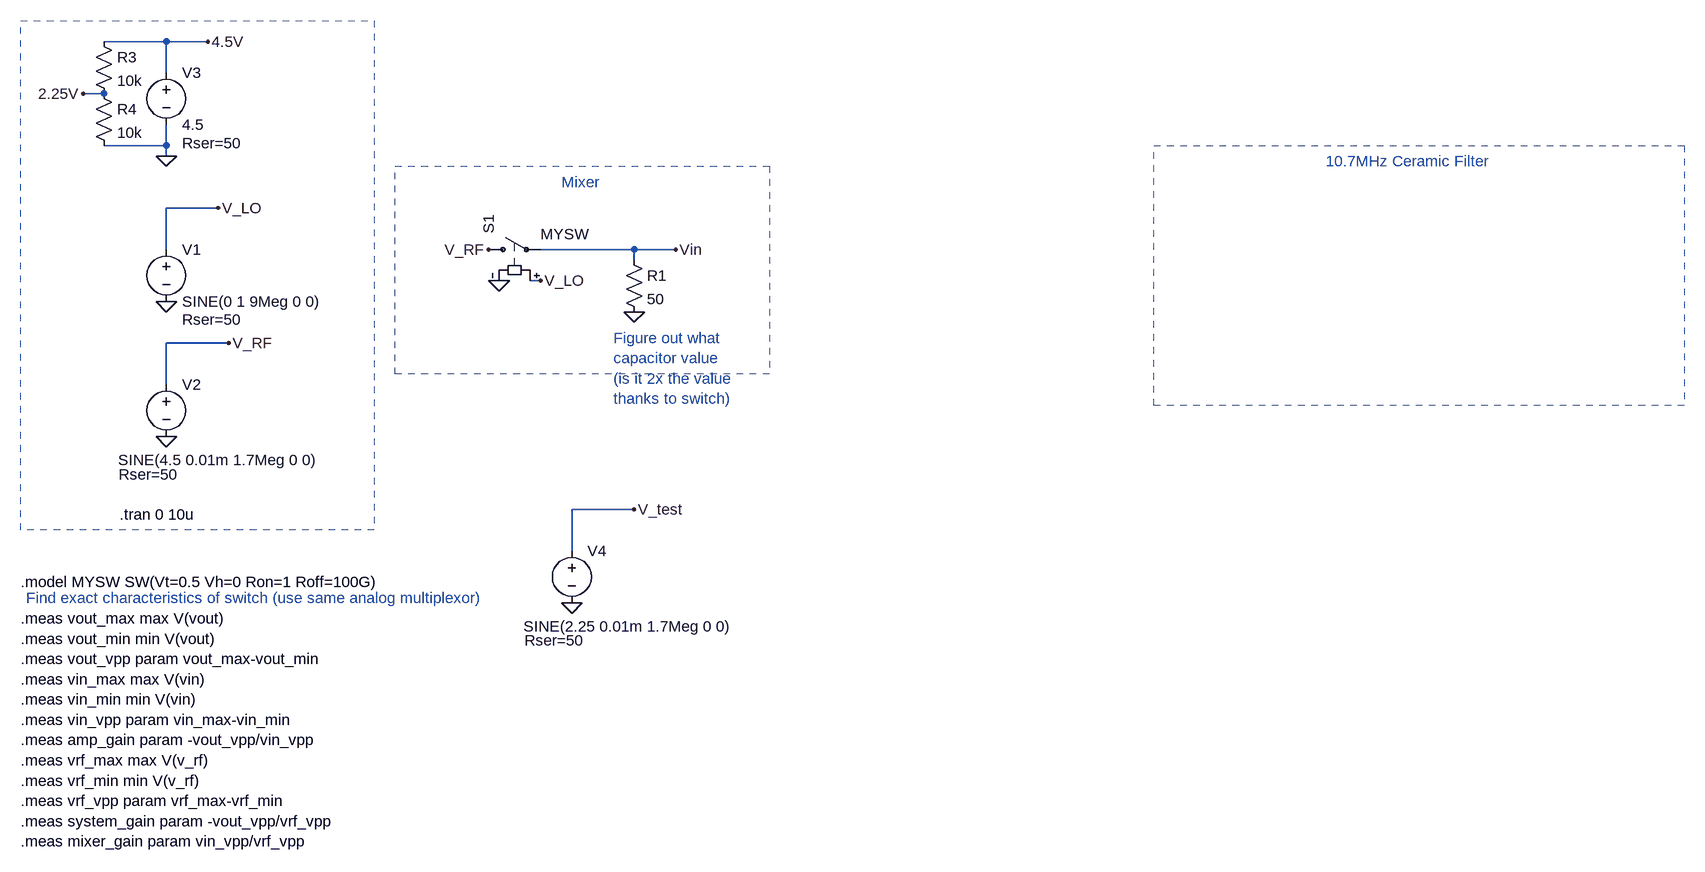
[diagram p0: schematic AM_Mixer.asc]
AM_Mixer.asc, the LTspice schematic file:
Version 4
SHEET 1 2308 1124
WIRE -368 -144 -464 -144
WIRE -304 -144 -368 -144
WIRE -368 -96 -368 -144
WIRE -464 -64 -496 -64
WIRE -368 16 -368 -16
WIRE -368 16 -464 16
WIRE -368 32 -368 16
WIRE -288 112 -368 112
WIRE -368 176 -368 112
WIRE 352 176 208 176
WIRE 416 176 352 176
WIRE 352 192 352 176
WIRE 208 224 192 224
WIRE -272 320 -368 320
WIRE -368 384 -368 320
WIRE 352 576 256 576
WIRE 256 640 256 576
FLAG -368 256 0
FLAG -288 112 V_LO
FLAG -368 464 0
FLAG -368 32 0
FLAG -304 -144 4.5V
FLAG -272 320 V_RF
FLAG 144 224 0
FLAG 208 224 V_LO
FLAG 352 272 0
FLAG 128 176 V_RF
FLAG 416 176 Vin
FLAG -496 -64 2.25V
FLAG 256 720 0
FLAG 352 576 V_test
SYMBOL voltage -368 160 R0
WINDOW 123 0 0 Left 0
WINDOW 39 24 124 Left 2
SYMATTR SpiceLine Rser=50
SYMATTR InstName V1
SYMATTR Value SINE(0 1 9Meg 0 0)
SYMBOL voltage -368 368 R0
WINDOW 123 0 0 Left 0
WINDOW 39 -73 154 Left 2
WINDOW 3 -74 132 Left 2
SYMATTR SpiceLine Rser=50
SYMATTR Value SINE(4.5 0.01m 1.7Meg 0 0)
SYMATTR InstName V2
SYMBOL voltage -368 -112 R0
WINDOW 123 0 0 Left 0
WINDOW 39 24 124 Left 2
SYMATTR SpiceLine Rser=50
SYMATTR InstName V3
SYMATTR Value 4.5
SYMBOL sw 112 176 R270
WINDOW 3 24 96 VRight 2
SYMATTR Value MYSW
SYMATTR InstName S1
SYMBOL res -480 -160 R0
SYMATTR InstName R3
SYMATTR Value 10k
SYMBOL res -480 -80 R0
SYMATTR InstName R4
SYMATTR Value 10k
SYMBOL voltage 256 624 R0
WINDOW 123 0 0 Left 0
WINDOW 39 -73 154 Left 2
WINDOW 3 -74 132 Left 2
SYMATTR SpiceLine Rser=50
SYMATTR Value SINE(2.25 0.01m 1.7Meg 0 0)
SYMATTR InstName V4
SYMBOL res 336 176 R0
SYMATTR InstName R1
SYMATTR Value 50
TEXT -440 584 Left 2 !.tran 0 10u
TEXT -592 688 Left 2 !.model MYSW SW(Vt=0.5 Vh=0 Ron=1 Roff=100G)
TEXT -592 744 Left 2 !.meas vout_max max V(vout)\n.meas vout_min min V(vout)\n.meas vout_vpp param vout_max-vout_min\n.meas vin_max max V(vin)\n.meas vin_min min V(vin)\n.meas vin_vpp param vin_max-vin_min\n.meas amp_gain param -vout_vpp/vin_vpp\n.meas vrf_max max V(v_rf)\n.meas vrf_min min V(v_rf)\n.meas vrf_vpp param vrf_max-vrf_min\n.meas system_gain param -vout_vpp/vrf_vpp\n.meas mixer_gain param vin_vpp/vrf_vpp
TEXT 320 312 Left 2 ;Figure out what\ncapacitor value\n(is it 2x the value\nthanks to switch)
TEXT 1416 40 Left 2 ;10.7MHz Ceramic Filter
TEXT 240 72 Left 2 ;Mixer
TEXT -584 712 Left 2 ;Find exact characteristics of switch (use same analog multiplexor)
RECTANGLE Normal -48 608 -592 -176 2
RECTANGLE Normal 560 368 -16 48 2
RECTANGLE Normal 1968 416 1152 16 2

The netlist it stands for:
* AM_Mixer.asc
V1 V_LO 0 SINE(0 1 9Meg 0 0) Rser=50
V2 V_RF 0 SINE(4.5 0.01m 1.7Meg 0 0) Rser=50
V3 4.5V 0 4.5 Rser=50
S1 V_RF Vin V_LO 0 MYSW
R3 4.5V 2.25V 10k
R4 2.25V 0 10k
V4 V_test 0 SINE(2.25 0.01m 1.7Meg 0 0) Rser=50
R1 Vin 0 50
.tran 0 10u
.model MYSW SW(Vt=0.5 Vh=0 Ron=1 Roff=100G)
.meas vout_max max V(vout)
.meas vout_min min V(vout)
.meas vout_vpp param vout_max-vout_min
.meas vin_max max V(vin)
.meas vin_min min V(vin)
.meas vin_vpp param vin_max-vin_min
.meas amp_gain param -vout_vpp/vin_vpp
.meas vrf_max max V(v_rf)
.meas vrf_min min V(v_rf)
.meas vrf_vpp param vrf_max-vrf_min
.meas system_gain param -vout_vpp/vrf_vpp
.meas mixer_gain param vin_vpp/vrf_vpp
* Figure out what
* capacitor value
* (is it 2x the value
* thanks to switch)
* 10.7MHz Ceramic Filter
* Mixer
* Find exact characteristics of switch (use same analog multiplexor)
.backanno
.end